# EasyEDA schematic SCH_MACROPAD.json
TITLE: Sheet_1; REV: 1.0; Date: 2023-10-29; Sheet: 1/1; Drawn By: rowanfoxx; Company: Your Company
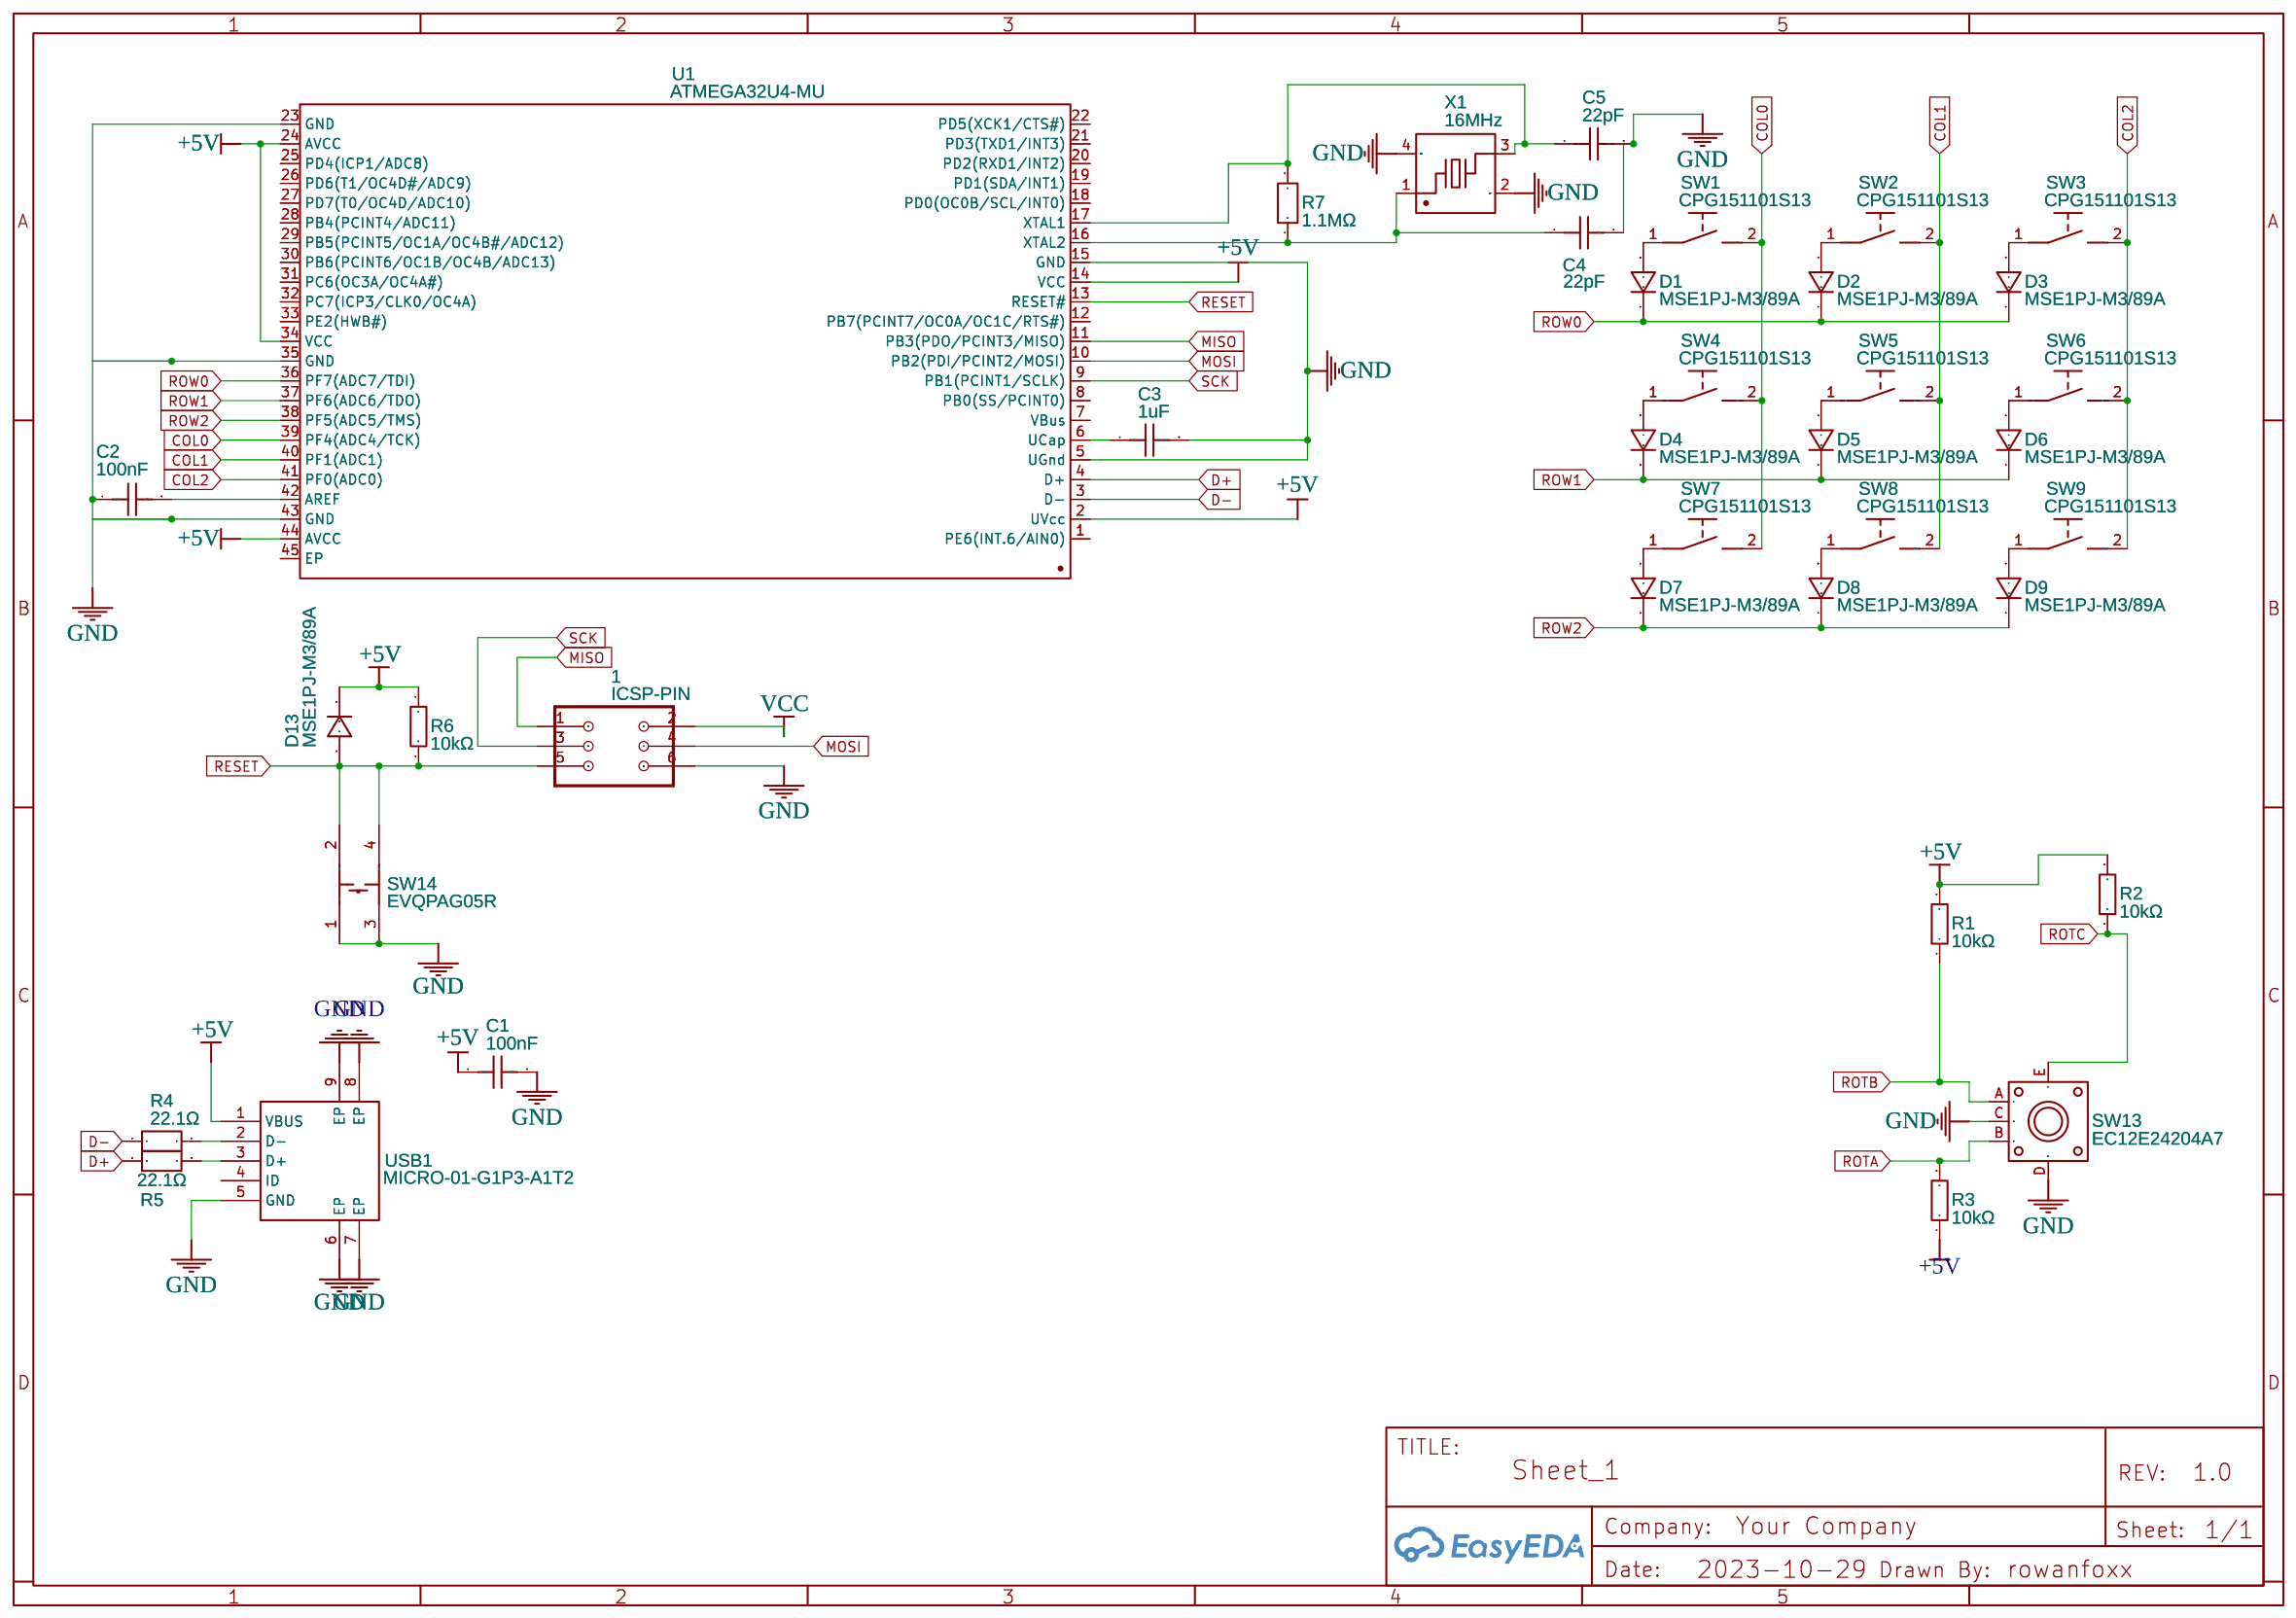
[diagram p0: schematic sheet]

## Parts
1  ICSP-PIN  [2X03-ICSP]
C1  100nF  [C0402]
C2  100nF  [C0402]
C3  1uF  [C0402]
C4  22pF  [C0402]
C5  22pF  [C0402]
D1  MSE1PJ-M3/89A  [MICROSMP_L2.2-W1.3-LS2.5-RD]
D2  MSE1PJ-M3/89A  [MICROSMP_L2.2-W1.3-LS2.5-RD]
D3  MSE1PJ-M3/89A  [MICROSMP_L2.2-W1.3-LS2.5-RD]
D4  MSE1PJ-M3/89A  [MICROSMP_L2.2-W1.3-LS2.5-RD]
D5  MSE1PJ-M3/89A  [MICROSMP_L2.2-W1.3-LS2.5-RD]
D6  MSE1PJ-M3/89A  [MICROSMP_L2.2-W1.3-LS2.5-RD]
D7  MSE1PJ-M3/89A  [MICROSMP_L2.2-W1.3-LS2.5-RD]
D8  MSE1PJ-M3/89A  [MICROSMP_L2.2-W1.3-LS2.5-RD]
D9  MSE1PJ-M3/89A  [MICROSMP_L2.2-W1.3-LS2.5-RD]
D13  MSE1PJ-M3/89A  [MICROSMP_L2.2-W1.3-LS2.5-RD]
R1  10kΩ  [R0603]
R2  10kΩ  [R0603]
R3  10kΩ  [R0603]
R4  22.1Ω  [R1210]
R5  22.1Ω  [R1210]
R6  10kΩ  [R0603]
R7  1.1MΩ  [R0805]
SW1  CPG151101S13  [KEY-TH_CPG1511F01S0X]
SW2  CPG151101S13  [KEY-TH_CPG1511F01S0X]
SW3  CPG151101S13  [KEY-TH_CPG1511F01S0X]
SW4  CPG151101S13  [KEY-TH_CPG1511F01S0X]
SW5  CPG151101S13  [KEY-TH_CPG1511F01S0X]
SW6  CPG151101S13  [KEY-TH_CPG1511F01S0X]
SW7  CPG151101S13  [KEY-TH_CPG1511F01S0X]
SW8  CPG151101S13  [KEY-TH_CPG1511F01S0X]
SW9  CPG151101S13  [KEY-TH_CPG1511F01S0X]
SW13  EC12E24204A7  [SW-TH_EC12EXXXX]
SW14  EVQPAG05R  [KEY-TH_4P-L6.0-W6.0-P4.50]
U1  ATMEGA32U4-MU  [VQFN-44_L7.0-W7.0-P0.50-BL-EP5.2]
USB1  MICRO-01-G1P3-A1T2  [MICRO-USB-SMD_MICRO-01-G3P3-A1T2]
X1  16MHz  [OSC-SMD_4P-L3.2-W2.5-BL]

## Library data of the parts
1 = ICSP-PIN: Contributor: RanjithKumarApaanpuri
C1 C2 = MT15B104K160CT: Contributor: LCSC; Supplier: LCSC; Supplier Part: C458949; Manufacturer: Walsin(华新科); JLCPCB Part Class: Extended Part; link: https://lcsc.com/eda_search?q=C458949&%26type=1&ref=editor
C3 = FS15B105K6R3PNG: Contributor: LCSC; Supplier: LCSC; Supplier Part: C525327; Manufacturer: PSA(信昌电陶); JLCPCB Part Class: Extended Part; link: https://lcsc.com/eda_search?q=C525327&%26type=1&ref=editor
C4 C5 = UMK105CG220JV-F: Contributor: LCSC; Supplier: LCSC; Supplier Part: C386131; Manufacturer: TAIYO YUDEN(太诱); JLCPCB Part Class: Extended Part; link: https://lcsc.com/eda_search?q=C386131&%26type=1&ref=editor
D1-D9 D13 = MSE1PJ-M3/89A: Contributor: LCSC; Supplier Part: C328592; Supplier: LCSC; Manufacturer: BLUE ROCKET(蓝箭); Manufacturer Part: 1N4007W; JLCPCB Part Class: Extended Part; link: https://lcsc.com/eda_search?q=C94470&%26type=1&ref=editor
R1-R3 R6 = RM06JTN103: Contributor: LCSC; Supplier: LCSC; Supplier Part: C702844; Manufacturer: HKR; Manufacturer Part: RCT0610KFLF; JLCPCB Part Class: Extended Part; link: https://lcsc.com/eda_search?q=C112924&%26type=1&ref=editor
R4 R5 = 1210W2F221JT5E: Contributor: LCSC; Supplier: LCSC; Supplier Part: C473513; Manufacturer: UNI-ROYAL(厚声); JLCPCB Part Class: Extended Part; link: https://lcsc.com/eda_search?q=C473513&%26type=1&ref=editor
R7 = WR08X115JTL: Contributor: LCSC; Supplier: LCSC; Supplier Part: C424786; Manufacturer: Walsin(华新科); JLCPCB Part Class: Extended Part; link: https://lcsc.com/eda_search?q=C424786&%26type=1&ref=editor
SW1-SW9 = CPG151101S13: Contributor: LCSC; Supplier: LCSC; Supplier Part: C400239; Manufacturer: Kailh(凯华); Manufacturer Part: CPG151101D91; JLCPCB Part Class: Extended Part; link: https://lcsc.com/eda_search?q=C404353&%26type=1&ref=editor
SW13 = EC12E24204A7: Contributor: LCSC; Supplier: LCSC; Supplier Part: C470597; Manufacturer: ALPSALPINE(阿尔卑斯阿尔派); JLCPCB Part Class: Extended Part; link: https://lcsc.com/eda_search?q=C470597&%26type=1&ref=editor
SW14 = EVQPAG05R: Contributor: LCSC; Supplier: LCSC; Manufacturer: PANASONIC(松下); Supplier Part: C79170; JLCPCB Part Class: Extended Part; link: https://lcsc.com/eda_search?q=C79170&%26type=1&ref=editor
U1 = ATMEGA32U4-MU: Supplier: LCSC; Manufacturer: MICROCHIP(美国微芯); Supplier Part: C112161; JLCPCB Part Class: Extended Part; link: https://lcsc.com/eda_search?q=C112161&%26type=1&ref=editor
USB1 = MICRO-01-G1P3-A1T2: Contributor: LCSC; Supplier: LCSC; Supplier Part: C2682506; Manufacturer: Yuandi(元迪); JLCPCB Part Class: Extended Part; link: https://lcsc.com/eda_search?q=C2682506&%26type=1&ref=editor
X1 = 7B016000H01: Contributor: LCSC; Supplier: LCSC; Supplier Part: C654968; Manufacturer: HD(浩都频率); JLCPCB Part Class: Extended Part; link: https://lcsc.com/eda_search?q=C654968&%26type=1&ref=editor

## Nets
+5V: C1.1 D13.1(C) R1.2 R2.2 R3.1 R6.1 U1.2(UVcc) U1.14(VCC) U1.24(AVCC) U1.34(VCC) U1.44(AVCC) USB1.1(VBUS)
GND: 1.6 C1.2 C2.1 C3.2 C4.2 C5.2 SW13.C SW13.D SW14.1 SW14.3 U1.5(UGnd) U1.15(GND) U1.23(GND) U1.35(GND) U1.43(GND) USB1.5(GND) USB1.6(EP) USB1.7(EP) USB1.8(EP) USB1.9(EP) X1.2(GND) X1.4(GND)
VCC: 1.2
COL0: SW1.2 SW4.2 SW7.2 U1.39(PF4(ADC4/TCK))
COL1: SW2.2 SW5.2 SW8.2 U1.40(PF1(ADC1))
COL2: SW3.2 SW6.2 SW9.2 U1.41(PF0(ADC0))
D+: R5.1 U1.4(D+)
D-: R4.1 U1.3(D-)
MISO: 1.1 U1.11(PB3(PDO/PCINT3/MISO))
MOSI: 1.4 U1.10(PB2(PDI/PCINT2/MOSI))
RESET: 1.5 D13.2(A) R6.2 SW14.2 SW14.4 U1.13(RESET#)
ROTA: R3.2 SW13.B
ROTB: R1.1 SW13.A
ROTC: R2.1 SW13.E
ROW0: D1.1(C) D2.1(C) D3.1(C) U1.36(PF7(ADC7/TDI))
ROW1: D4.1(C) D5.1(C) D6.1(C) U1.37(PF6(ADC6/TDO))
ROW2: D7.1(C) D8.1(C) D9.1(C) U1.38(PF5(ADC5/TMS))
SCK: 1.3 U1.9(PB1(PCINT1/SCLK))
Net-(C2-2): C2.2 U1.42(AREF)
Net-(C3-1): C3.1 U1.6(UCap)
Net-(C4-1): C4.1 R7.1 U1.16(XTAL2) X1.1(IN)
Net-(C5-1): C5.1 R7.2 U1.17(XTAL1) X1.3(OUT)
Net-(D1-2): D1.2(A) SW1.1
Net-(D2-2): D2.2(A) SW2.1
Net-(D3-2): D3.2(A) SW3.1
Net-(D4-2): D4.2(A) SW4.1
Net-(D5-2): D5.2(A) SW5.1
Net-(D6-2): D6.2(A) SW6.1
Net-(D7-2): D7.2(A) SW7.1
Net-(D8-2): D8.2(A) SW8.1
Net-(D9-2): D9.2(A) SW9.1
Net-(R4-2): R4.2 USB1.2(D-)
Net-(R5-2): R5.2 USB1.3(D+)

Not connected (* = marked no-connect by the designer): U1 1(PE6(INT.6/AIN0)) 7(VBus) 8(PB0(SS/PCINT0)) 12(PB7(PCINT7/OC0A/OC1C/RTS#)) 18(PD0(OC0B/SCL/INT0)) 19(PD1(SDA/INT1)) 20(PD2(RXD1/INT2)) 21(PD3(TXD1/INT3)) 22(PD5(XCK1/CTS#)) 25(PD4(ICP1/ADC8)) 26(PD6(T1/OC4D#/ADC9)) 27(PD7(T0/OC4D/ADC10)) 28(PB4(PCINT4/ADC11)) 29(PB5(PCINT5/OC1A/OC4B#/ADC12)) 30(PB6(PCINT6/OC1B/OC4B/ADC13)) 31(PC6(OC3A/OC4A#)) 32(PC7(ICP3/CLK0/OC4A)) 33(PE2(HWB#)) 45(EP); USB1 4(ID)
